# Altium schematic sheet 21.RK3588_CONFIG.SchDoc
size A4; SheetNumber: 21; SheetTotal: 21
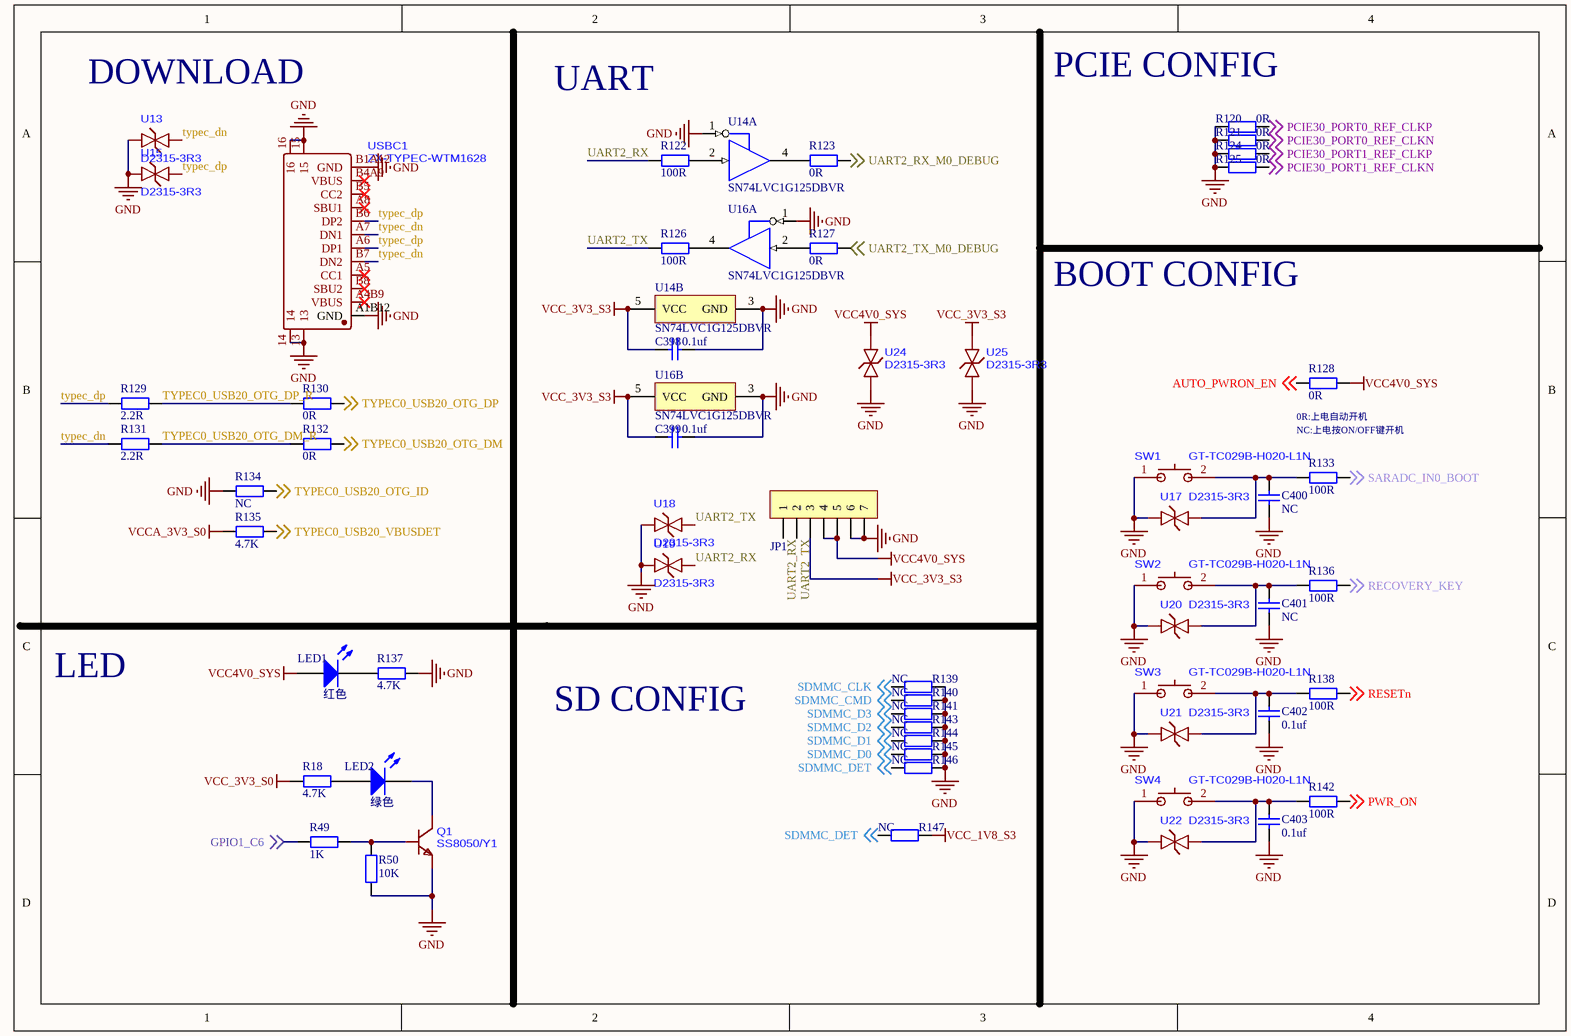
[diagram p0: 21.RK3588_CONFIG.SchDoc]

## Parts
C398  0.1uf  [C0402_L]
C399  0.1uf  [C0402_L]
C400  NC  [C0402_L]
C401  NC  [C0402_L]
C402  0.1uf  [C0402_L]
C403  0.1uf  [C0402_L]
JP1  CON-6P  [SH1.0-WT-7P]  (value not drawn)
LED1  红色  [LED0603_R]
LED2  绿色  [LED0603_R]
Q1  SS8050/Y1  [SOT-23-3_L2.9-W1.3-P1.90-LS2.4-TL]
R18  4.7K  [R0402_L]
R49  1K  [R0402_L]
R50  10K  [R0402_L]
R120  0R  [R0402_L]
R121  0R  [R0402_L]
R122  100R  [R0402_L]
R123  0R  [R0402_L]
R124  0R  [R0402_L]
R125  0R  [R0402_L]
R126  100R  [R0402_L]
R127  0R  [R0402_L]
R128  0R  [R0402_L]
R129  2.2R  [R0402_L]
R130  0R  [R0402_L]
R131  2.2R  [R0402_L]
R132  0R  [R0402_L]
R133  100R  [R0402_L]
R134  NC  [R0402_L]
R135  4.7K  [R0402_L]
R136  100R  [R0402_L]
R137  4.7K  [R0402_L]
R138  100R  [R0402_L]
R139  NC  [R0402_L]
R140  NC  [R0402_L]
R141  NC  [R0402_L]
R142  100R  [R0402_L]
R143  NC  [R0402_L]
R144  NC  [R0402_L]
R145  NC  [R0402_L]
R146  NC  [R0402_L]
R147  NC  [R0402_L]
SW1  GT-TC029B-H020-L1N  [SW-SMD_L3.9-W2.9-P4.15-LS5.0]
SW2  GT-TC029B-H020-L1N  [SW-SMD_L3.9-W2.9-P4.15-LS5.0]
SW3  GT-TC029B-H020-L1N  [SW-SMD_L3.9-W2.9-P4.15-LS5.0]
SW4  GT-TC029B-H020-L1N  [SW-SMD_L3.9-W2.9-P4.15-LS5.0]
U13  D2315-3R3  [DFN1006-2L-BI]
U14  SN74LVC1G125DBVR  [SOT23-5]  (parts A,B of 2)
U15  D2315-3R3  [DFN1006-2L-BI]
U16  SN74LVC1G125DBVR  [SOT23-5]  (parts A,B of 2)
U17  D2315-3R3  [DFN1006-2L-BI]
U18  D2315-3R3  [DFN1006-2L-BI]
U19  D2315-3R3  [DFN1006-2L-BI]
U20  D2315-3R3  [DFN1006-2L-BI]
U21  D2315-3R3  [DFN1006-2L-BI]
U22  D2315-3R3  [DFN1006-2L-BI]
U24  D2315-3R3  [DFN1006-2L-BI]
U25  D2315-3R3  [DFN1006-2L-BI]
USBC1  ZX-TYPEC-WTM1628  [USB-C-SMD_ZX-TYPEC-WTM1628]

## Nets
GND: C398.2 C399.2 C400.1 C401.1 C402.1 C403.1 JP1.6 JP1.7 Q1.2(E) R50.1 R120.1 R121.1 R124.1 R125.1 R134.1 R137.2 R139.2 R140.2 R141.2 R143.2 R144.2 R145.2 R146.2 SW1.1 SW2.1 SW3.1 SW4.1 U13.1 U14.1(~{OE}) U14.3(GND) U15.1 U16.1(~{OE}) U16.3(GND) U17.1 U18.1 U19.1 U20.1 U21.1 U22.1 U24.1 U25.1 USBC1.13 USBC1.14 USBC1.15 USBC1.16 USBC1.A1B12(GND) USBC1.B1A12(GND)
VCC4V0_SYS: JP1.4 JP1.5 LED1.1(A) R128.2 U24.2
VCC_1V8_S3: R147.2
VCC_3V3_S0: R18.1
VCC_3V3_S3: C398.1 C399.1 JP1.3 U14.5(VCC) U16.5(VCC) U25.2
VCCA_3V3_S0: R135.1
AUTO_PWRON_EN: R128.1 ; off-sheet AUTO_PWRON_EN
GPIO1_C6: R49.1 ; off-sheet GPIO1_C6
PCIE30_PORT0_REF_CLKN: R121.2 ; off-sheet PCIE30_PORT0_REF_CLKN
PCIE30_PORT0_REF_CLKP: R120.2 ; off-sheet PCIE30_PORT0_REF_CLKP
PCIE30_PORT1_REF_CLKN: R125.2 ; off-sheet PCIE30_PORT1_REF_CLKN
PCIE30_PORT1_REF_CLKP: R124.2 ; off-sheet PCIE30_PORT1_REF_CLKP
PWR_ON: R142.2 ; off-sheet PWR_ON
RECOVERY_KEY: R136.2 ; off-sheet RECOVERY_KEY
RESETn: R138.2 ; off-sheet RESETn
SARADC_IN0_BOOT: R133.2 ; off-sheet SARADC_IN0_BOOT
SDMMC_CLK: R139.1 ; off-sheet SDMMC_CLK
SDMMC_CMD: R140.1 ; off-sheet SDMMC_CMD
SDMMC_D0: R145.1 ; off-sheet SDMMC_D0
SDMMC_D1: R144.1 ; off-sheet SDMMC_D1
SDMMC_D2: R143.1 ; off-sheet SDMMC_D2
SDMMC_D3: R141.1 ; off-sheet SDMMC_D3
SDMMC_DET: R146.1 R147.1 ; off-sheet SDMMC_DET
TYPEC0_USB20_OTG_DM: R132.2 ; off-sheet TYPEC0_USB20_OTG_DM
TYPEC0_USB20_OTG_DM_R: R131.2 R132.1
TYPEC0_USB20_OTG_DP: R130.2 ; off-sheet TYPEC0_USB20_OTG_DP
TYPEC0_USB20_OTG_DP_R: R129.2 R130.1
TYPEC0_USB20_OTG_ID: R134.2 ; off-sheet TYPEC0_USB20_OTG_ID
TYPEC0_USB20_VBUSDET: R135.2 ; off-sheet TYPEC0_USB20_VBUSDET
typec_dn: R131.1 U13.2 USBC1.A7(DN1) USBC1.B7(DN2)
typec_dp: R129.1 U15.2 USBC1.A6(DP1) USBC1.B6(DP2)
UART2_RX: JP1.1 R122.1 U19.2
UART2_RX_M0_DEBUG: R123.2 ; off-sheet UART2_RX_M0_DEBUG
UART2_TX: JP1.2 R126.1 U18.2
UART2_TX_M0_DEBUG: R127.2 ; off-sheet UART2_TX_M0_DEBUG
NetC400_2: C400.2 R133.1 SW1.2 U17.2
NetC401_2: C401.2 R136.1 SW2.2 U20.2
NetC402_2: C402.2 R138.1 SW3.2 U21.2
NetC403_2: C403.2 R142.1 SW4.2 U22.2
NetLED1_2: LED1.2(K) R137.1
NetLED2_1: LED2.1(A) R18.2
NetLED2_2: LED2.2(K) Q1.3(C)
NetQ1_1: Q1.1(B) R49.2 R50.2
NetR122_2: R122.2 U14.2(A)
NetR123_1: R123.1 U14.4(Y)
NetR126_2: R126.2 U16.4(Y)
NetR127_1: R127.1 U16.2(A)

Not connected (* = marked no-connect by the designer): USBC1 A4B9(VBUS)* A5(CC1)* A8(SBU1)* B4A9(VBUS)* B5(CC2)* B8(SBU2)*

## Notes on the sheet
- (near U13) DOWNLOAD
- UART
- PCIE CONFIG
- BOOT CONFIG
- (near R128) 0R:上电自动开机
- NC:上电按ON/OFF键开机
- LED
- SD CONFIG

## Library data of the parts
C398-C403 = C: 贴片电容/MLCC电容
JP1 = Header 7: 7P连接器
LED1 LED2 = LED: 贴片LED
R18 R49 R50 R120-R147 = R: 贴片电阻
U14 U16 = SN74LVC1G125DBVR: 三态输出单路总线缓冲器闸